# Altium project keypad4x5.PrjPcb
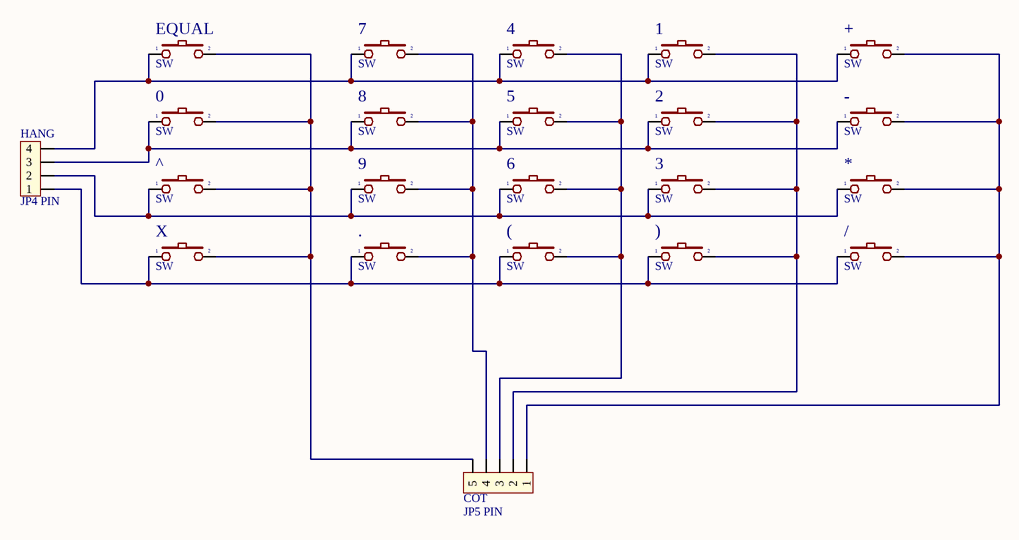
[diagram p0: keypad4x5.SchDoc]
1 sheet, 22 parts. Net scope: global (net labels, ports and power ports of the same name join across sheets).
Board file: keypad4x5.PcbDoc

## Sheet keypad4x5.SchDoc
size A; SheetNumber: 1; SheetTotal: 1

### Parts
0  SW  [SW2]
1  SW  [SW2]
2  SW  [SW2]
3  SW  [SW2]
4  SW  [SW2]
5  SW  [SW2]
6  SW  [SW2]
7  SW  [SW2]
8  SW  [SW2]
9  SW  [SW2]
(  SW  [SW2]
)  SW  [SW2]
*  SW  [SW2]
+  SW  [SW2]
-  SW  [SW2]
.  SW  [SW2]
/  SW  [SW2]
^  SW  [SW2]
COT  JP5 PIN  [JP5]
EQUAL  SW  [SW2]
HANG  JP4 PIN  [JP4]
X  SW  [SW2]

### Nets
Net0_1: 0.1 2.1 5.1 8.1 -.1 HANG.3
Net0_2: 0.2 ^.2 COT.5 EQUAL.2 X.2
Net1_1: 1.1 4.1 7.1 +.1 EQUAL.1 HANG.4
Net1_2: 1.2 2.2 3.2 ).2 COT.2
Net3_1: 3.1 6.1 9.1 *.1 ^.1 HANG.2
Net4_2: 4.2 5.2 6.2 (.2 COT.3
Net7_2: 7.2 8.2 9.2 ..2 COT.4
Net(_1: (.1 ).1 ..1 /.1 HANG.1 X.1
Net*_2: *.2 +.2 -.2 /.2 COT.1

### Library data of the parts
0-9 ( ) * + - . / ^ EQUAL X = SW2: Switch button 2 pin; Value: SW chip 2 pin
COT = JP5: Value: JP5
HANG = JP4: Value: JP4